# Altium schematic sheet S11_LEDs.SchDoc: LEDs
size 381 x 241 mm; SheetNumber: 11; SheetTotal: 12
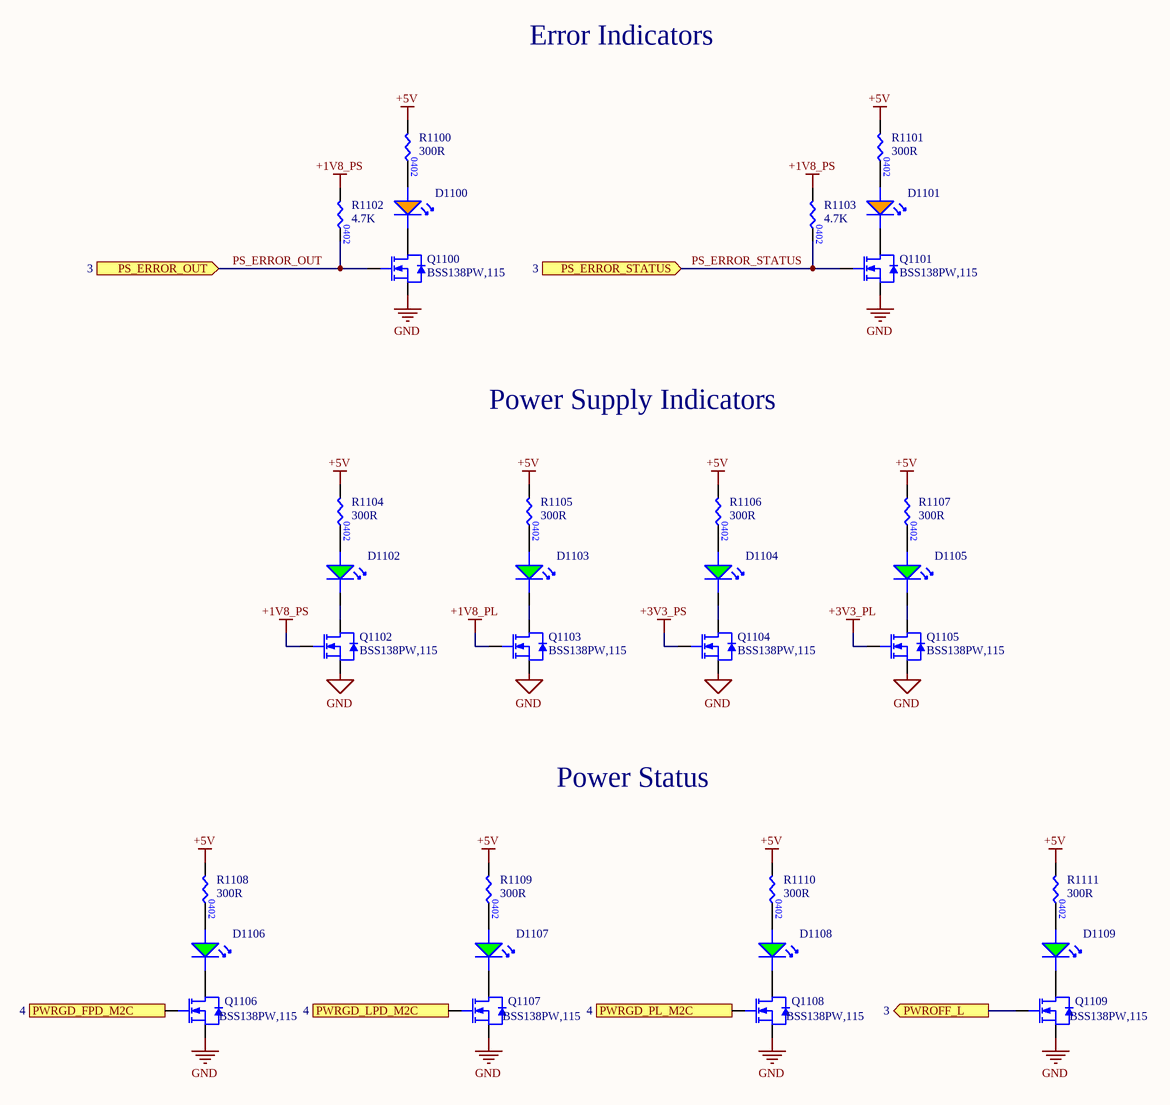
[diagram p0: S11_LEDs.SchDoc]

## Parts
D1100  GENERIC LED - ORANGE  [LED_0603]  (value not drawn)
D1101  GENERIC LED - ORANGE  [LED_0603]  (value not drawn)
D1102  GENERIC LED - GREEN  [LED_0603]  (value not drawn)
D1103  GENERIC LED - GREEN  [LED_0603]  (value not drawn)
D1104  GENERIC LED - GREEN  [LED_0603]  (value not drawn)
D1105  GENERIC LED - GREEN  [LED_0603]  (value not drawn)
D1106  GENERIC LED - GREEN  [LED_0603]  (value not drawn)
D1107  GENERIC LED - GREEN  [LED_0603]  (value not drawn)
D1108  GENERIC LED - GREEN  [LED_0603]  (value not drawn)
D1109  GENERIC LED - GREEN  [LED_0603]  (value not drawn)
Q1100  BSS138PW,115  [NEXPERIA_SOT323]
Q1101  BSS138PW,115  [NEXPERIA_SOT323]
Q1102  BSS138PW,115  [NEXPERIA_SOT323]
Q1103  BSS138PW,115  [NEXPERIA_SOT323]
Q1104  BSS138PW,115  [NEXPERIA_SOT323]
Q1105  BSS138PW,115  [NEXPERIA_SOT323]
Q1106  BSS138PW,115  [NEXPERIA_SOT323]
Q1107  BSS138PW,115  [NEXPERIA_SOT323]
Q1108  BSS138PW,115  [NEXPERIA_SOT323]
Q1109  BSS138PW,115  [NEXPERIA_SOT323]
R1100  Resistance: 300R  [RES0402]  (hidden comment: RES_0402)
R1101  Resistance: 300R  [RES0402]  (hidden comment: RES_0402)
R1102  Resistance: 4.7K  [RES0402]  (hidden comment: RES_0402)
R1103  Resistance: 4.7K  [RES0402]  (hidden comment: RES_0402)
R1104  Resistance: 300R  [RES0402]  (hidden comment: RES_0402)
R1105  Resistance: 300R  [RES0402]  (hidden comment: RES_0402)
R1106  Resistance: 300R  [RES0402]  (hidden comment: RES_0402)
R1107  Resistance: 300R  [RES0402]  (hidden comment: RES_0402)
R1108  Resistance: 300R  [RES0402]  (hidden comment: RES_0402)
R1109  Resistance: 300R  [RES0402]  (hidden comment: RES_0402)
R1110  Resistance: 300R  [RES0402]  (hidden comment: RES_0402)
R1111  Resistance: 300R  [RES0402]  (hidden comment: RES_0402)

## Ports
PS_ERROR_OUT (in, see 3), PS_ERROR_STATUS (in, see 3), PWRGD_FPD_M2C (out, see 4), PWRGD_LPD_M2C (out, see 4), PWRGD_PL_M2C (out, see 4), PWROFF_L (out, see 3)

## Nets
+1V8_PL: Q1103.1(Gate)
+1V8_PS: Q1102.1(Gate) R1102.1 R1103.1
+3V3_PL: Q1105.1(Gate)
+3V3_PS: Q1104.1(Gate)
+5V: R1100.1 R1101.1 R1104.1 R1105.1 R1106.1 R1107.1 R1108.1 R1109.1 R1110.1 R1111.1
GND: Q1100.2(Source) Q1101.2(Source) Q1102.2(Source) Q1103.2(Source) Q1104.2(Source) Q1105.2(Source) Q1106.2(Source) Q1107.2(Source) Q1108.2(Source) Q1109.2(Source)
PS_ERROR_OUT: Q1100.1(Gate) R1102.2 ; port PS_ERROR_OUT
PS_ERROR_STATUS: Q1101.1(Gate) R1103.2 ; port PS_ERROR_STATUS
PWRGD_FPD_M2C: Q1106.1(Gate) ; port PWRGD_FPD_M2C
PWRGD_LPD_M2C: Q1107.1(Gate) ; port PWRGD_LPD_M2C
PWRGD_PL_M2C: Q1108.1(Gate) ; port PWRGD_PL_M2C
PWROFF_L: Q1109.1(Gate) ; port PWROFF_L
NetD1100_A: D1100.A(Anode) R1100.2
NetD1100_K: D1100.K(Cathode) Q1100.3(Drain)
NetD1101_A: D1101.A(Anode) R1101.2
NetD1101_K: D1101.K(Cathode) Q1101.3(Drain)
NetD1102_A: D1102.A(Anode) R1104.2
NetD1102_K: D1102.K(Cathode) Q1102.3(Drain)
NetD1103_A: D1103.A(Anode) R1105.2
NetD1103_K: D1103.K(Cathode) Q1103.3(Drain)
NetD1104_A: D1104.A(Anode) R1106.2
NetD1104_K: D1104.K(Cathode) Q1104.3(Drain)
NetD1105_A: D1105.A(Anode) R1107.2
NetD1105_K: D1105.K(Cathode) Q1105.3(Drain)
NetD1106_A: D1106.A(Anode) R1108.2
NetD1106_K: D1106.K(Cathode) Q1106.3(Drain)
NetD1107_A: D1107.A(Anode) R1109.2
NetD1107_K: D1107.K(Cathode) Q1107.3(Drain)
NetD1108_A: D1108.A(Anode) R1110.2
NetD1108_K: D1108.K(Cathode) Q1108.3(Drain)
NetD1109_A: D1109.A(Anode) R1111.2
NetD1109_K: D1109.K(Cathode) Q1109.3(Drain)

## Notes on the sheet
- Error Indicators
- Power Supply Indicators
- Power Status
- Engineer
- Date
- Revision
- Sheet Number

## Library data of the parts
D1100 D1101 = .LED_ORANGE: Manufacturer Part Number: 150060AS75000
D1102-D1109 = .LED_GREEN: Manufacturer Part Number: 150060VS75000
Q1100-Q1109 = BSS138PW,115: MOSFET N-CH 60V 320MA SOT323
R1100 R1101 R1104-R1111 = .RES_RC0402FR-07300RL: RES 300 OHM 1% 1/16W 0402; Manufacturer: YAGEO; Manufacturer Part Number: RC0402FR-07300RL; Case/Package: 0402; Tolerance: 1%
R1102 R1103 = .RES_RC0402FR-074K7L: RES 4.7K OHM 1% 1/16W 0402; Manufacturer: YAGEO; Manufacturer Part Number: RC0402FR-074K7L; Case/Package: 0402; Tolerance: 1%